# Altium project MiniRoverShield.PrjPcb
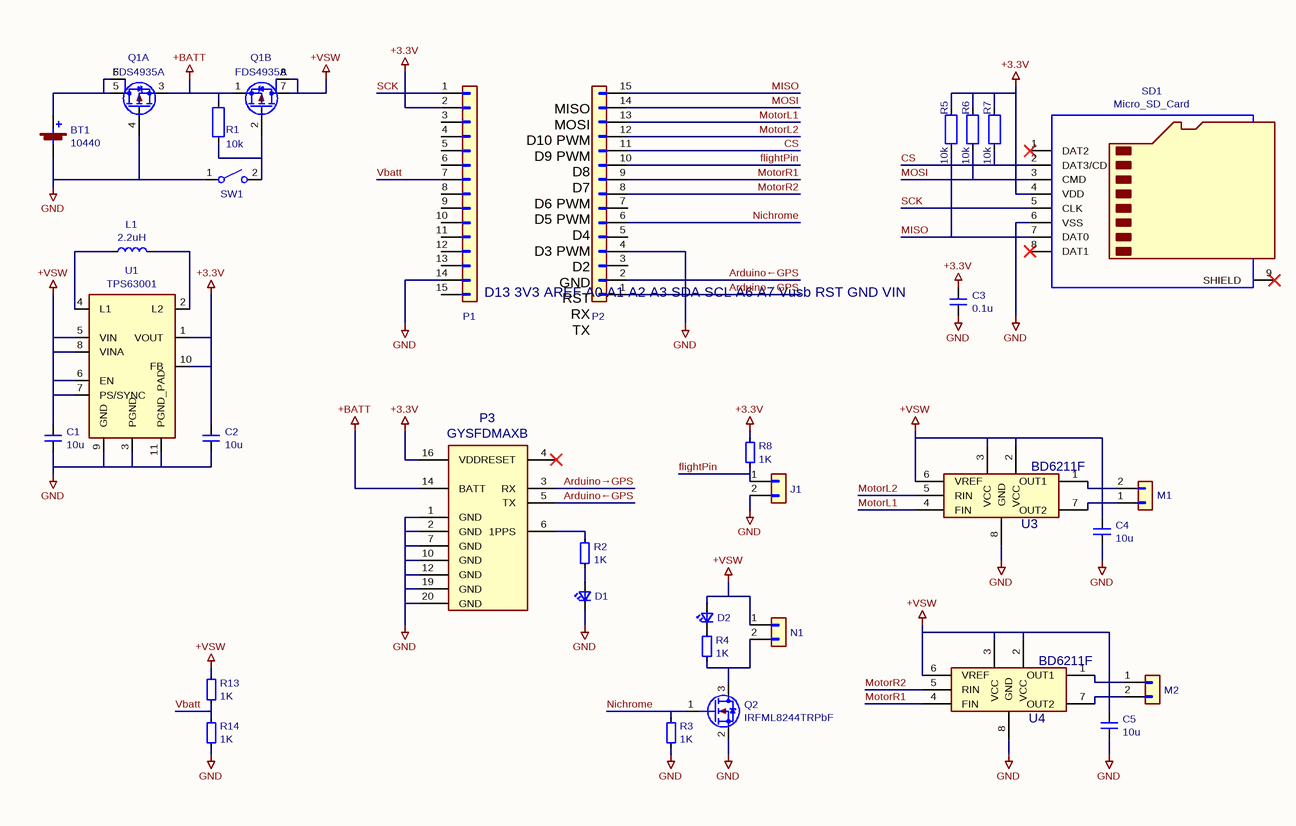
[diagram p0: MiniRoverShield.SchDoc]
1 sheet, 33 parts. Net scope: global (net labels, ports and power ports of the same name join across sheets).
Board file: MiniRoverShield(1).PcbDoc

## Sheet MiniRoverShield.SchDoc
size 297 x 210 mm

### Parts
BT1  10440  [BC-0402_AAA]
C1  10u  [C_0805_2012Metric_Pad1.15x1.40mm_HandSolder]
C2  10u  [C_0805_2012Metric_Pad1.15x1.40mm_HandSolder]
C3  0.1u  [C_0603_1608Metric_Pad1.05x0.95mm_HandSolder]
C4  10u  [C_0805_2012Metric_Pad1.15x1.40mm_HandSolder]
C5  10u  [C_0805_2012Metric_Pad1.15x1.40mm_HandSolder]
D1  RED  [LED_0603_1608Metric_Castellated]  (value not drawn)
D2  RED  [LED_0603_1608Metric_Castellated]  (value not drawn)
J1  flightPin  [PinHeader_1x02_P2.54mm_Horizontal]  (value not drawn)
L1  2.2uH  [TDK_VLS3012]
M1  Motor  [JST_EH_B02B-EH-A_1x02_P2.50mm_Vertical]  (value not drawn)
M2  Motor  [JST_EH_B02B-EH-A_1x02_P2.50mm_Vertical]  (value not drawn)
N1  Nichrome  [MPT0.5_2-2.54]  (value not drawn)
P1  Arduino nano 33  [PinSocket_1x15_P2.54mm_Vertical]  (value not drawn)
P2  Arduino nano 33  [PinSocket_1x15_P2.54mm_Vertical]  (value not drawn)
P3  GYSFDMAXB  [GYSFDMAXB]
Q1  FDS4935A  [SOIC-8_3.9x4.9mm_P1.27mm]  (parts A,B of 2)
Q2  IRFML8244TRPbF  [SOT-23]
R1  10k  [R_0603_1608Metric_Pad1.05x0.95mm_HandSolder]
R2  1K  [R_0603_1608Metric_Pad1.05x0.95mm_HandSolder]
R3  1K  [R_0603_1608Metric_Pad1.05x0.95mm_HandSolder]
R4  1K  [R_0603_1608Metric_Pad1.05x0.95mm_HandSolder]
R5  10k  [R_0603_1608Metric_Pad1.05x0.95mm_HandSolder]
R6  10k  [R_0603_1608Metric_Pad1.05x0.95mm_HandSolder]
R7  10k  [R_0603_1608Metric_Pad1.05x0.95mm_HandSolder]
R8  1K  [R_0603_1608Metric_Pad1.05x0.95mm_HandSolder]
R13  1K  [R_0603_1608Metric_Pad1.05x0.95mm_HandSolder]
R14  1K  [R_0603_1608Metric_Pad1.05x0.95mm_HandSolder]
SD1  Micro_SD_Card  [microSD_HC_Hirose_DM3AT-SF-PEJM5]
SW1  Power  [SS-12D01-VG4]  (value not drawn)
U1  TPS63001  [Texas_S-PVSON-N10_ThermalVias]
U3  BD6211F  [SOIC-8_3.9x4.9mm_P1.27mm]
U4  BD6211F  [SOIC-8_3.9x4.9mm_P1.27mm]

### Nets
+3.3V: C2.1 C3.1 P1.2(Pin_2) P3.16(VDD) R5.1 R6.1 R7.1 R8.1 SD1.4(VDD) U1.1(VOUT) U1.10(FB)
+BATT: P3.14(BATT) Q1.1(S) Q1.3(S) R1.1
+VSW: C1.1 C4.1 C5.1 D2.2(A) N1.1(Pin_1) Q1.7(D) Q1.8(D) R13.1 U1.5(VIN) U1.6(EN) U1.7(PS/SYNC) U1.8(VINA) U3.2(VCC) U3.3(VCC) U3.6(VREF) U4.2(VCC) U4.3(VCC) U4.6(VREF)
GND: BT1.2(-) C1.2 C2.2 C3.2 C4.2 C5.2 D1.1(K) J1.2(Pin_2) P1.14(Pin_14) P2.4(Pin_4) P3.1(GND) P3.2(GND) P3.7(GND) P3.10(GND) P3.12(GND) P3.19(GND) P3.20(GND) Q1.4(G) Q2.2(S) R3.2 R14.2 SD1.6(VSS) SW1.1(A) U1.3(PGND) U1.9(GND) U1.11(PGND_PAD) U3.8(GND) U4.8(GND)
Arduino←GPS: P2.2(Pin_2) P3.5(TX)
Arduino→GPS: P2.1(Pin_1) P3.3(RX)
CS: P2.11(Pin_11) R7.2 SD1.2(DAT3/CD)
flightPin: J1.1(Pin_1) P2.10(Pin_10) R8.2
MISO: P2.15(Pin_15) R5.2 SD1.7(DAT0)
MOSI: P2.14(Pin_14) R6.2 SD1.3(CMD)
MotorL1: P2.13(Pin_13) U3.4(FIN)
MotorL2: P2.12(Pin_12) U3.5(RIN)
MotorR1: P2.9(Pin_9) U4.4(FIN)
MotorR2: P2.8(Pin_8) U4.5(RIN)
Nichrome: P2.6(Pin_6) Q2.1(G) R3.1
SCK: P1.1(Pin_1) SD1.5(CLK)
Vbatt: P1.7(Pin_7) R13.2 R14.1
NetBT1_1: BT1.1(+) Q1.5(D) Q1.6(D)
NetD1_2: D1.2(A) R2.2
NetD2_1: D2.1(K) R4.1
NetL1_1: L1.1 U1.4(L1)
NetL1_2: L1.2 U1.2(L2)
NetM1_1: M1.1(Pin_1) U3.7(OUT2)
NetM1_2: M1.2(Pin_2) U3.1(OUT1)
NetM2_1: M2.1(Pin_1) U4.1(OUT1)
NetM2_2: M2.2(Pin_2) U4.7(OUT2)
NetN1_2: N1.2(Pin_2) Q2.3(D) R4.2
NetP3_6: P3.6(1PPS) R2.1
NetQ1_2: Q1.2(4G) R1.2 SW1.2(B)

Not connected (* = marked no-connect by the designer): P1 3(Pin_3) 4(Pin_4) 5(Pin_5) 6(Pin_6) 8(Pin_8) 9(Pin_9) 10(Pin_10) 11(Pin_11) 12(Pin_12) 13(Pin_13) 15(Pin_15); P2 3(Pin_3) 5(Pin_5) 7(Pin_7); P3 4(RESET)*; SD1 1(DAT2)* 8(DAT1)* 9(SHIELD)*

### Notes on the sheet
- (near P2) MISO
  MOSI
  D10 PWM
  D9 PWM
  D8
  D7
  D6 PWM
  D5 PWM
  D4
  D3 PWM
  D2
  GND
  RST
  RX
  TX
- D13
  3V3
  AREF
  A0
  A1
  A2
  A3
  SDA
  SCL
  A6
  A7
  Vusb
  RST
  GND
  VIN
- 1
- 2
- 3
- 4
- 5
- 6
- A
- B
- C
- D
- Title: MiniRoverShield
- File: MiniRoverShield.sch
- Sheet: /
- n_yosihisa
- KiCad E.D.A.  kicad (5.1.4)-1
- Size: A4
- Date: 2019-07-28
- Rev: 0.1
- Id: 1/1

### Library data of the parts
BT1 = Battery_Cell: Value: 10440; Footprint: user:BC-0402_AAA
C1-C5 = C_Small
  C1 C2 C4 C5: Value: 10u; Footprint: Capacitor_SMD:C_0805_2012Metric_Pad1.15x1.40mm_HandSolder
  C3: Value: 0.1u; Footprint: Capacitor_SMD:C_0603_1608Metric_Pad1.05x0.95mm_HandSolder
D1 D2 = LED_Small: Value: RED; Footprint: LED_SMD:LED_0603_1608Metric_Castellated
J1 M1 M2 N1 = Conn_01x02
  J1: Value: flightPin; Footprint: Connector_PinHeader_2.54mm:PinHeader_1x02_P2.54mm_Horizontal
  M1 M2: Value: Motor; Footprint: Connector_JST:JST_EH_B02B-EH-A_1x02_P2.50mm_Vertical
  N1: Value: Nichrome; Footprint: user:MPT0.5_2-2.54
L1 = L: Value: 2.2uH; Footprint: user_library:TDK_VLS3012
P1 P2 = Conn_01x15: Value: Arduino nano 33; Footprint: Connector_PinSocket_2.54mm:PinSocket_1x15_P2.54mm_Vertical
P3 = GYSFDMAXB-user_library: Value: GYSFDMAXB; Footprint: user:GYSFDMAXB
Q1 = FDS4935A-user_library: Value: FDS4935A; Footprint: Package_SO:SOIC-8_3.9x4.9mm_P1.27mm
Q2 = Q_NMOS_GSD: Value: IRFML8244TRPbF; Footprint: Package_TO_SOT_SMD:SOT-23
R1 R5-R7 = R: Value: 10k; Footprint: Resistor_SMD:R_0603_1608Metric_Pad1.05x0.95mm_HandSolder
R2-R4 R8 R13 R14 = R_Small: Value: 1K; Footprint: Resistor_SMD:R_0603_1608Metric_Pad1.05x0.95mm_HandSolder
SD1 = Micro_SD_Card-Connector: Value: Micro_SD_Card; Footprint: Connector_Card:microSD_HC_Hirose_DM3AT-SF-PEJM5
SW1 = SW_SPST: Value: Power; Footprint: user:SS-12D01-VG4
U1 = TPS63000-user_library: Value: TPS63001; Footprint: Package_SON:Texas_S-PVSON-N10_ThermalVias
U3 U4 = BD6231F_2-user_library: Value: BD6211F; Footprint: Package_SO:SOIC-8_3.9x4.9mm_P1.27mm